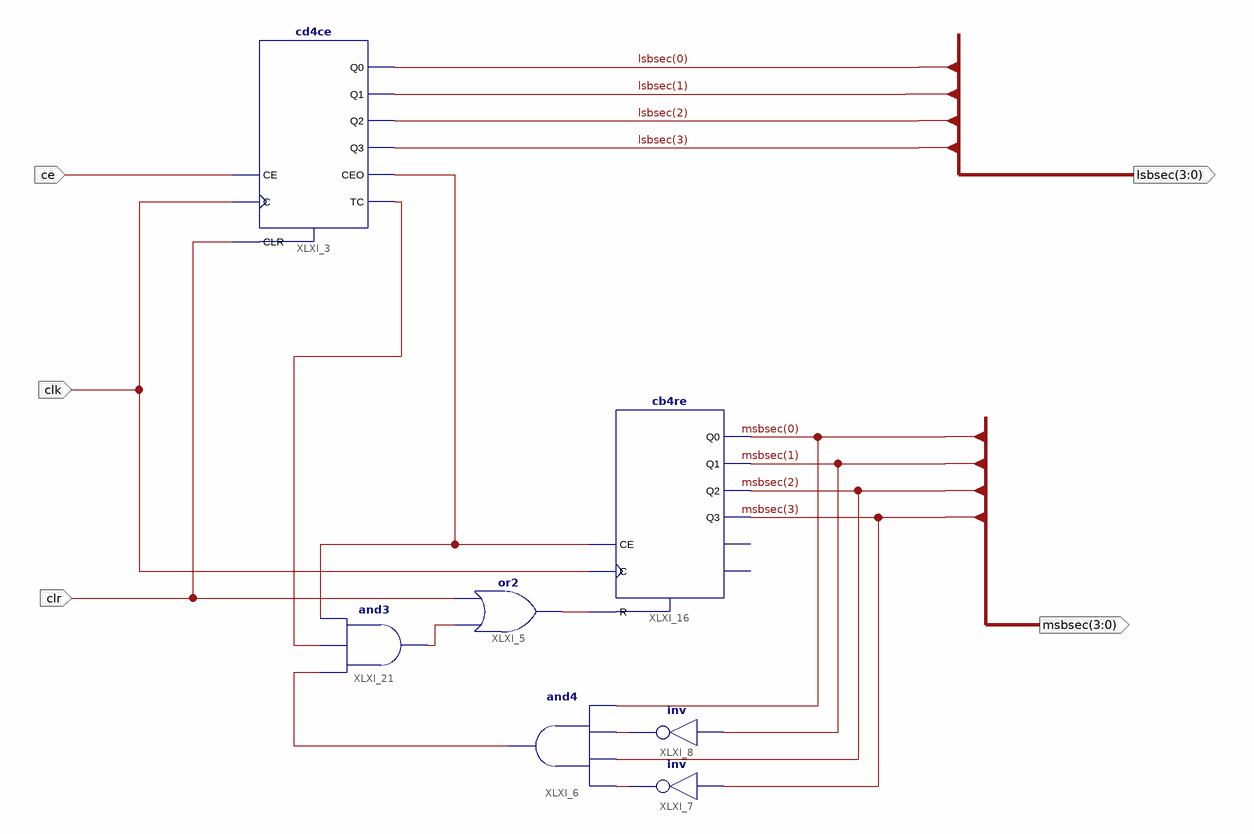
[diagram p0: schematic sheet 1]
// Xilinx ISE schematic cnt60.sch (spartan3e) as structural Verilog: 7 symbols, 5 ports
module cnt60 (
  input  clk,
  input  clr,
  input  ce,
  output [3:0] lsbsec,
  output [3:0] msbsec
);

  wire fifty, msb_en, nine, XLXN_21, XLXN_23, XLXN_64, XLXN_65;

  cd4ce XLXI_3 (
    .C(clk), .CE(ce), .CLR(clr), .CEO(msb_en), .Q0(lsbsec[0]), .Q1(lsbsec[1]), .Q2(lsbsec[2]),
    .Q3(lsbsec[3]), .TC(nine));
  or XLXI_5 (XLXN_21, XLXN_23, clr);
  and XLXI_6 (fifty, msbsec[0], XLXN_65, msbsec[2], XLXN_64);
  not XLXI_7 (XLXN_64, msbsec[3]);
  not XLXI_8 (XLXN_65, msbsec[1]);
  cb4re XLXI_16 (
    .C(clk), .CE(msb_en), .R(XLXN_21), .Q0(msbsec[0]), .Q1(msbsec[1]), .Q2(msbsec[2]), .Q3(msbsec[3]));  // open: CEO, TC
  and XLXI_21 (XLXN_23, fifty, nine, msb_en);
endmodule
